# EAGLE design EMI_SHIELD (EAGLE 7.2.0)
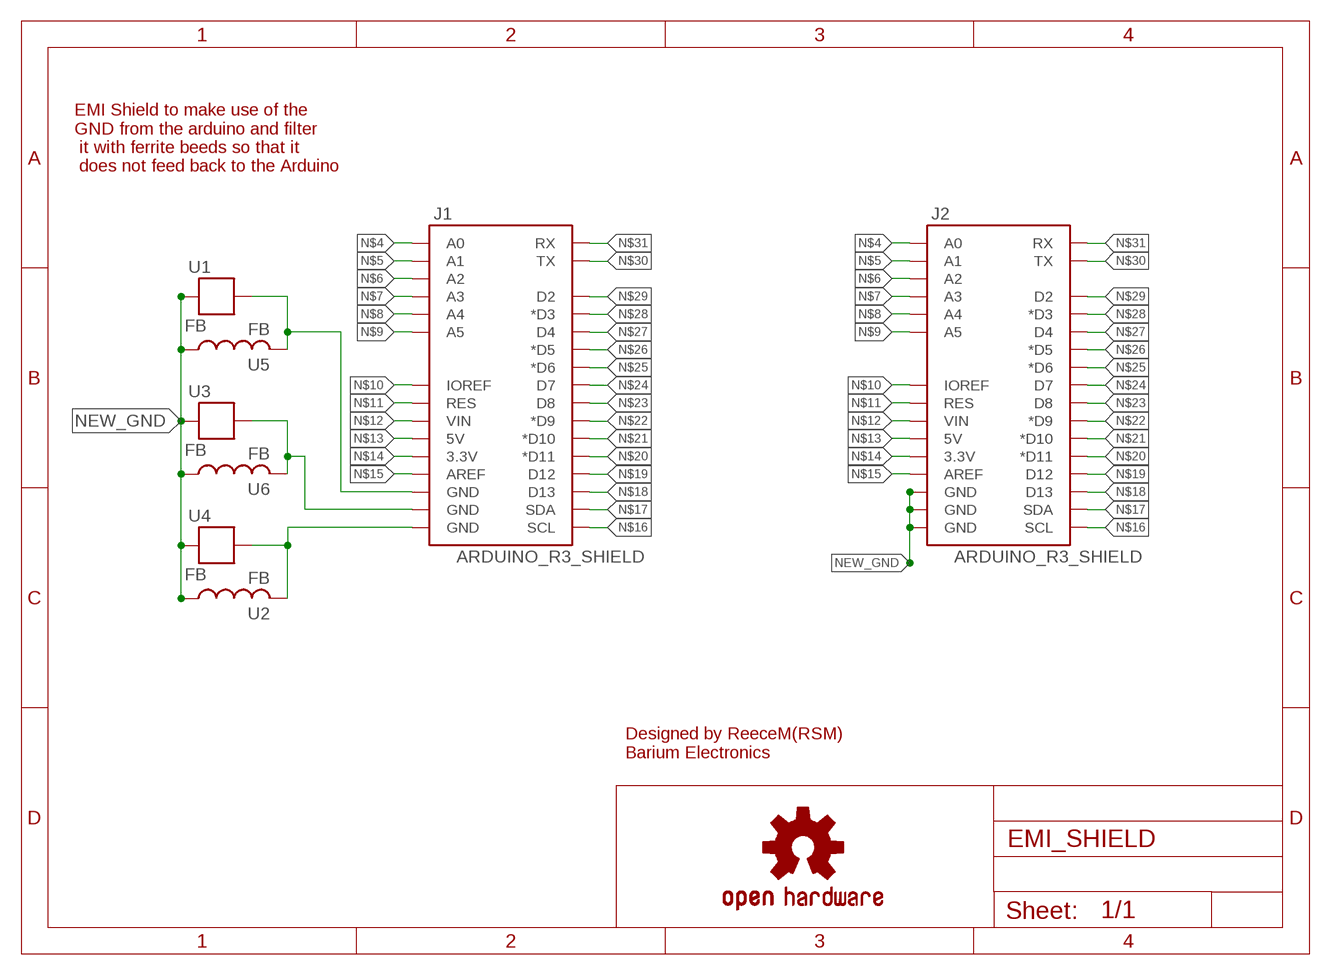
[diagram p0: schematic, sheet 1]

## Parts
J1  ARDUINO_R3_SHIELD  [UNO_R3_SHIELD]
J2  ARDUINO_R3_SHIELD  [UNO_R3_SHIELD]
LOGO1  OSHW-LOGOM-COPPER  [OSHW-LOGO-M_COPPER]
U1  FB  [0603]
U2  FB  [FB]
U3  FB  [0603]
U4  FB  [0603]
U5  FB  [FB]
U6  FB  [FB]

## Nets
N$1: J1.GND@2(GND) U1.1 U5.P$2
N$2: J1.GND@1(GND) U3.1 U6.P$2
N$3: J1.GND@0(GND) U2.P$2 U4.1
N$4: J1.A0 J2.A0
N$5: J1.A1 J2.A1
N$6: J1.A2 J2.A2
N$7: J1.A3 J2.A3
N$8: J1.A4 J2.A4
N$9: J1.A5 J2.A5
N$10: J1.IOREF J2.IOREF
N$11: J1.RES J2.RES
N$12: J1.VIN J2.VIN
N$13: J1.5V J2.5V
N$14: J1.3.3V J2.3.3V
N$15: J1.AREF J2.AREF
N$16: J1.SCL J2.SCL
N$17: J1.SDA J2.SDA
N$18: J1.D13 J2.D13
N$19: J1.D12 J2.D12
N$20: J1.D11(*D11) J2.D11(*D11)
N$21: J1.D10(*D10) J2.D10(*D10)
N$22: J1.D9(*D9) J2.D9(*D9)
N$23: J1.D8 J2.D8
N$24: J1.D7 J2.D7
N$25: J1.D6(*D6) J2.D6(*D6)
N$26: J1.D5(*D5) J2.D5(*D5)
N$27: J1.D4 J2.D4
N$28: J1.D3(*D3) J2.D3(*D3)
N$29: J1.D2 J2.D2
N$30: J1.TX J2.TX
N$31: J1.RX J2.RX
NEW_GND: J2.GND@0(GND) J2.GND@1(GND) J2.GND@2(GND) U1.2 U2.P$1 U3.2 U4.2 U5.P$1 U6.P$1

## Notes on the sheet
- EMI Shield to make use of the 
  GND from the arduino and filter
   it with ferrite beeds so that it
   does not feed back to the Arduino
- Designed by ReeceM(RSM)
  Barium Electronics

## Library data of the parts
J1 J2 = SparkFun-Boards:ARDUINO_R3_SHIELD: Shield form compatible with the Arduino Uno R3.
LOGO1 = SparkFun-Aesthetics:OSHW-LOGO: Open Source Hardware Logo This logo indicates the piece of hardware it is found on incorporates a OSHW license and/or adheres to the definition of open source hardware found here: http://freedomdefined.org/OSHW
U1 U3 U4 = SparkFun-Passives:FB
U2 U5 U6 = adafruit:FB: Ferrite bead Digikey #P9821BK-ND

## Board
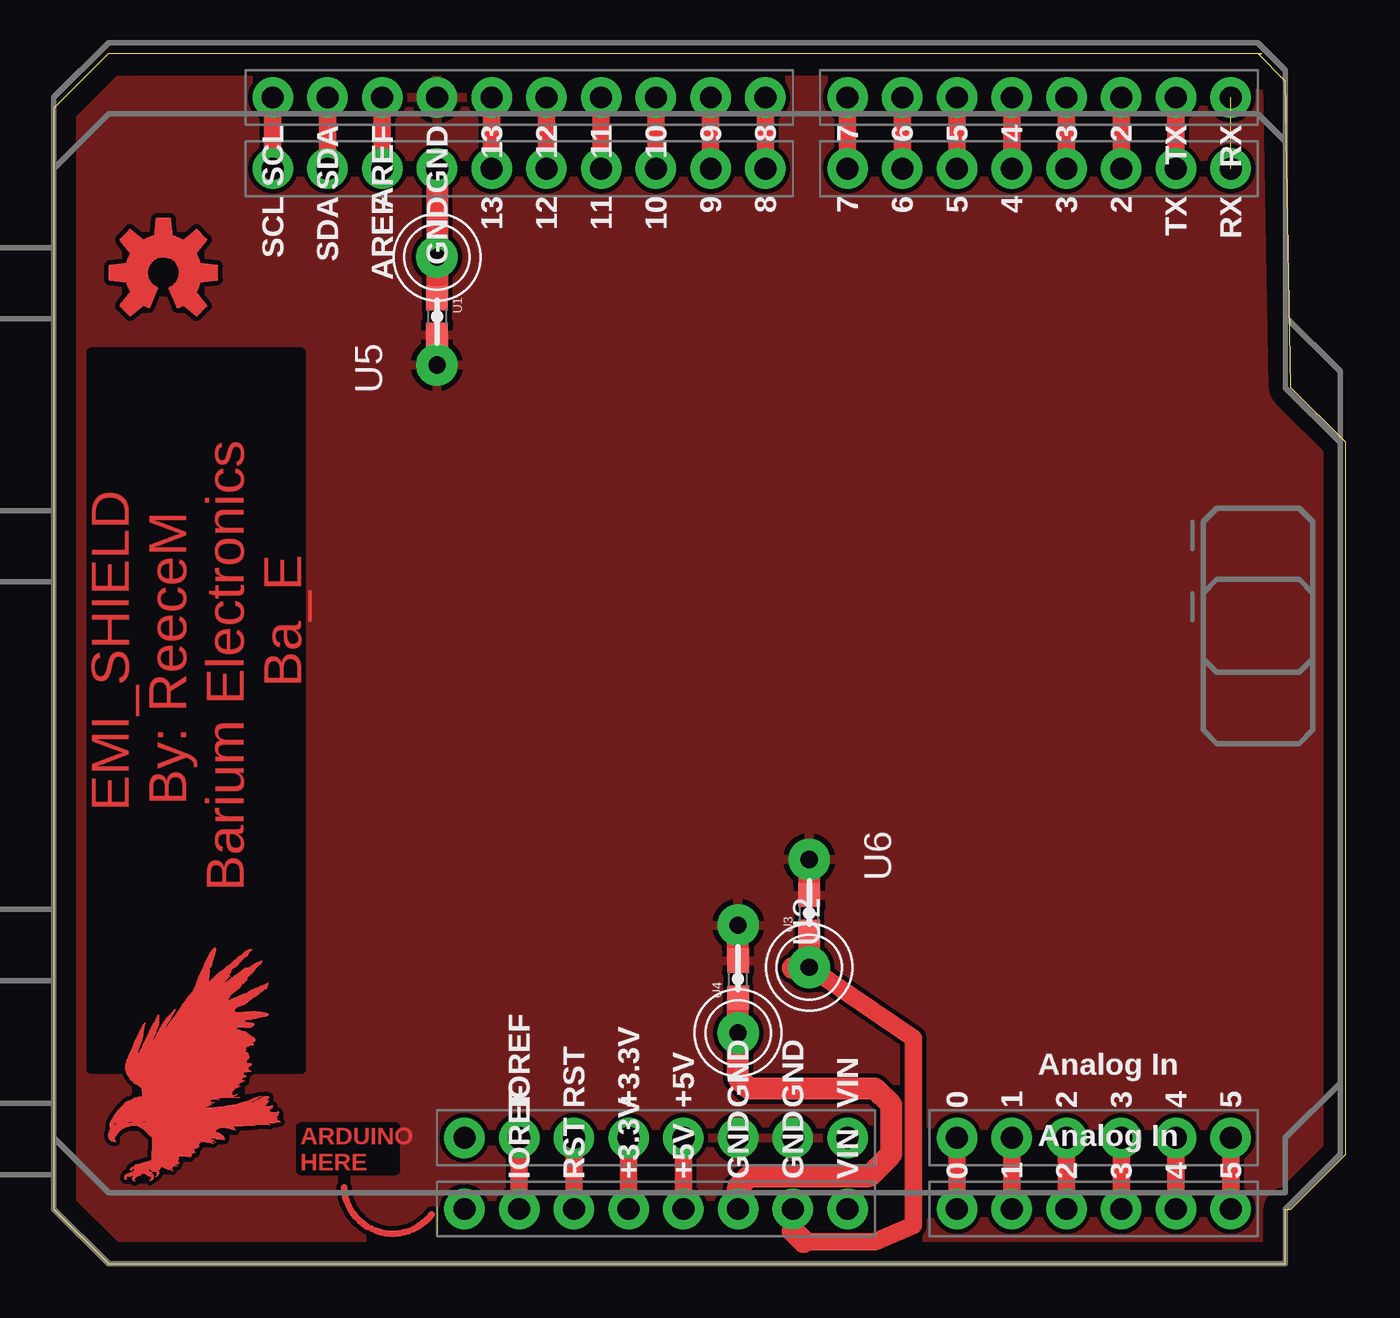
[diagram p1: board, top side]
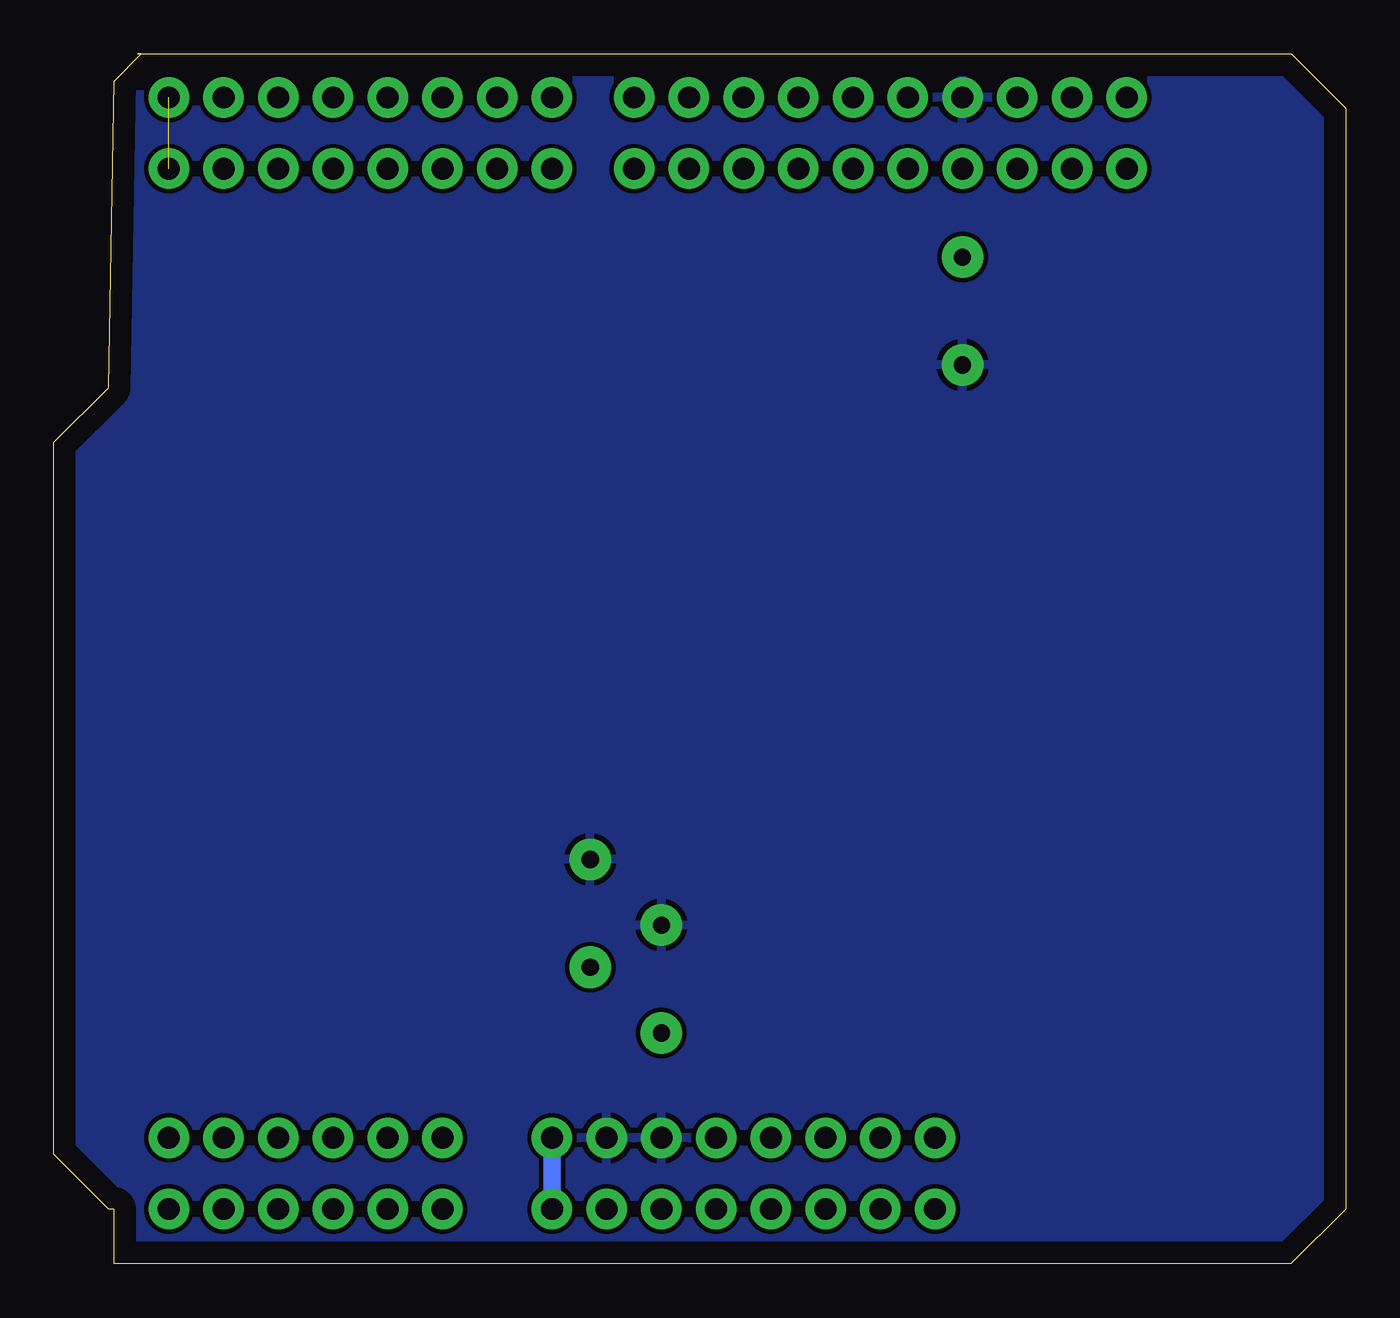
[diagram p2: board, bottom side, seen from below]

Size 59.94 x 56.12 mm. Coordinates in mm from the lower left corner, seen from the top.
Outline: 55.89,56.12 57.15,54.86 57.4,40.64 59.94,38.1 59.94,5.08 57.4,2.54 57.15,2.54 57.15,0 57.07,0 2.54,0 0,2.54 0,53.59 2.53,56.12 2.54,56.12 55.89,56.12
Outline: 55.89,56.12 56.06,56.12 55.89,56.12
Copper layers (1*16): Top 0.035mm / dielectric 1.5mm / Bottom 0.035mm
Design rules "default": minimum track width 10mil, minimum drill 24mil, track to track 8mil, track to pad 8mil, pad to pad 8mil, via to via 8mil, smd to smd 8mil, copper to edge 40mil, drill to drill 8mil, minimum pad ring 10mil, minimum via ring 8mil, stop-mask expansion 4mil, vias tented up to drill 0mil, thermal gap 10mil

### Footprints (pad centres in the part's own frame; a part is rotated, then mirrored left to right if it is on the bottom)
UNO_R3_SHIELD = drill 1.016 pad 1.88: 3.3V 50.8,26.67; 5V 50.8,29.21; A0 50.8,41.91; A1 50.8,44.45; A2 50.8,46.99; A3 50.8,49.53; A4 50.8,52.07; A5 50.8,54.61; AREF 2.54,15.24; D2 2.54,49.53; D3 2.54,46.99; D4 2.54,44.45; D5 2.54,41.91; D6 2.54,39.37; D7 2.54,36.83; D8 2.54,33.02; D9 2.54,30.48; D10 2.54,27.94; D11 2.54,25.4; D12 2.54,22.86; D13 2.54,20.32; GND@0 50.8,31.75; GND@1 50.8,34.29; GND@2 2.54,17.78; IOREF 50.8,21.59; NC 50.8,19.05; RES 50.8,24.13; RX 2.54,54.61; SCL 2.54,10.16; SDA 2.54,12.7; TX 2.54,52.07; VIN 50.8,36.83
0603 = smd 1.1 x 1: 1 -0.85,0; 2 0.85,0
FB = drill 0.8 pad 1.93: P$1 -2.5,0; P$2 2.5,0

### Placement (x,y rotation side)
J1  0,53.34 270 top
J2  0,56.64 270 top
LOGO1  5.08,45.97 0 top
U1  17.78,43.94 270 top
U2  31.75,13.21 270 top
U3  35.05,16.26 90 top
U4  31.75,13.21 90 top
U5  17.78,44.2 90 top
U6  35.05,16.26 270 top
U$1  [EAGLE-TOP-8MM]  2.54,3.81 0 top

### Tracks (layer width: path | path; a pad name or v marks a point on that pad's centre or on a via)
N$1
  Top 1.016: J1.GND@2 U5.P$2 U1.1
N$2
  Top 0.813: 34.8,1.02 38.1,1.02 39.88,1.78 39.88,10.45 U6.P$2
  Top 1.016: 34.29,13.72 35.05,13.72 U6.P$2 U3.1 | J1.GND@1 34.29,1.52 34.8,1.02
N$3
  Top 1.016: U4.1 U2.P$2 31.75,8.64 32.26,8.13 38.1,8.13 38.86,7.37 38.86,5.08 37.85,4.06 32.26,4.06 31.75,3.56 J1.GND@0
N$4
  Top 0.813: J1.A0 J2.A0
N$5
  Top 0.813: J1.A1 J2.A1
N$6
  Top 0.813: J1.A2 J2.A2
N$7
  Top 0.813: J1.A3 J2.A3
N$8
  Top 0.813: J2.A4 J1.A4
N$9
  Top 0.813: J2.A5 J1.A5
N$10
  Top 0.813: J2.IOREF J1.IOREF
N$11
  Top 0.813: J2.RES J1.RES
N$12
  Bottom 0.813: J2.VIN J1.VIN
N$13
  Top 0.813: J2.5V J1.5V
N$14
  Top 0.813: J2.3.3V J1.3.3V
N$15
  Top 0.813: J2.AREF J1.AREF
N$16
  Top 0.813: J1.SCL J2.SCL
N$17
  Top 0.813: J2.SDA J1.SDA
N$18
  Top 0.813: J2.D13 J1.D13
N$19
  Top 0.813: J2.D12 J1.D12
N$20
  Top 0.813: J2.D11 J1.D11
N$21
  Top 0.813: J1.D10 J2.D10
N$22
  Top 0.813: J2.D9 J1.D9
N$23
  Top 0.813: J2.D8 J1.D8
N$24
  Top 0.813: J2.D7 J1.D7
N$25
  Top 0.813: J2.D6 J1.D6
N$26
  Top 0.813: J2.D5 J1.D5
N$27
  Top 0.813: J2.D4 J1.D4
N$28
  Top 0.813: J2.D3 J1.D3
N$29
  Top 0.813: J2.D2 J1.D2
N$30
  Top 0.813: J2.TX J1.TX
N$31  (1 unrouted)
N$32
  Top 0.305: 17.53,2.29 arc-140 13.46,3.56
NEW_GND
  Top 1.016: U1.2 U5.P$1 | U4.2 U2.P$1 | U3.2 U6.P$1
  pour Top: 2.29,0 -0.25,2.54 0,51.05 2.29,55.88 57.15,55.63 57.4,40.64 59.69,38.35 59.69,5.59 56.9,2.79 56.9,0
  pour Bottom: 2.29,0 56.9,0 56.9,3.05 59.44,5.59 59.44,38.35 57.4,40.39 56.64,55.63 1.78,56.13 0,51.05 -0.25,2.54

### Text on the board
Top: EMI_SHIELD / By: ReeceM / Barium Electronics / Ba_E | ARDUINO / HERE